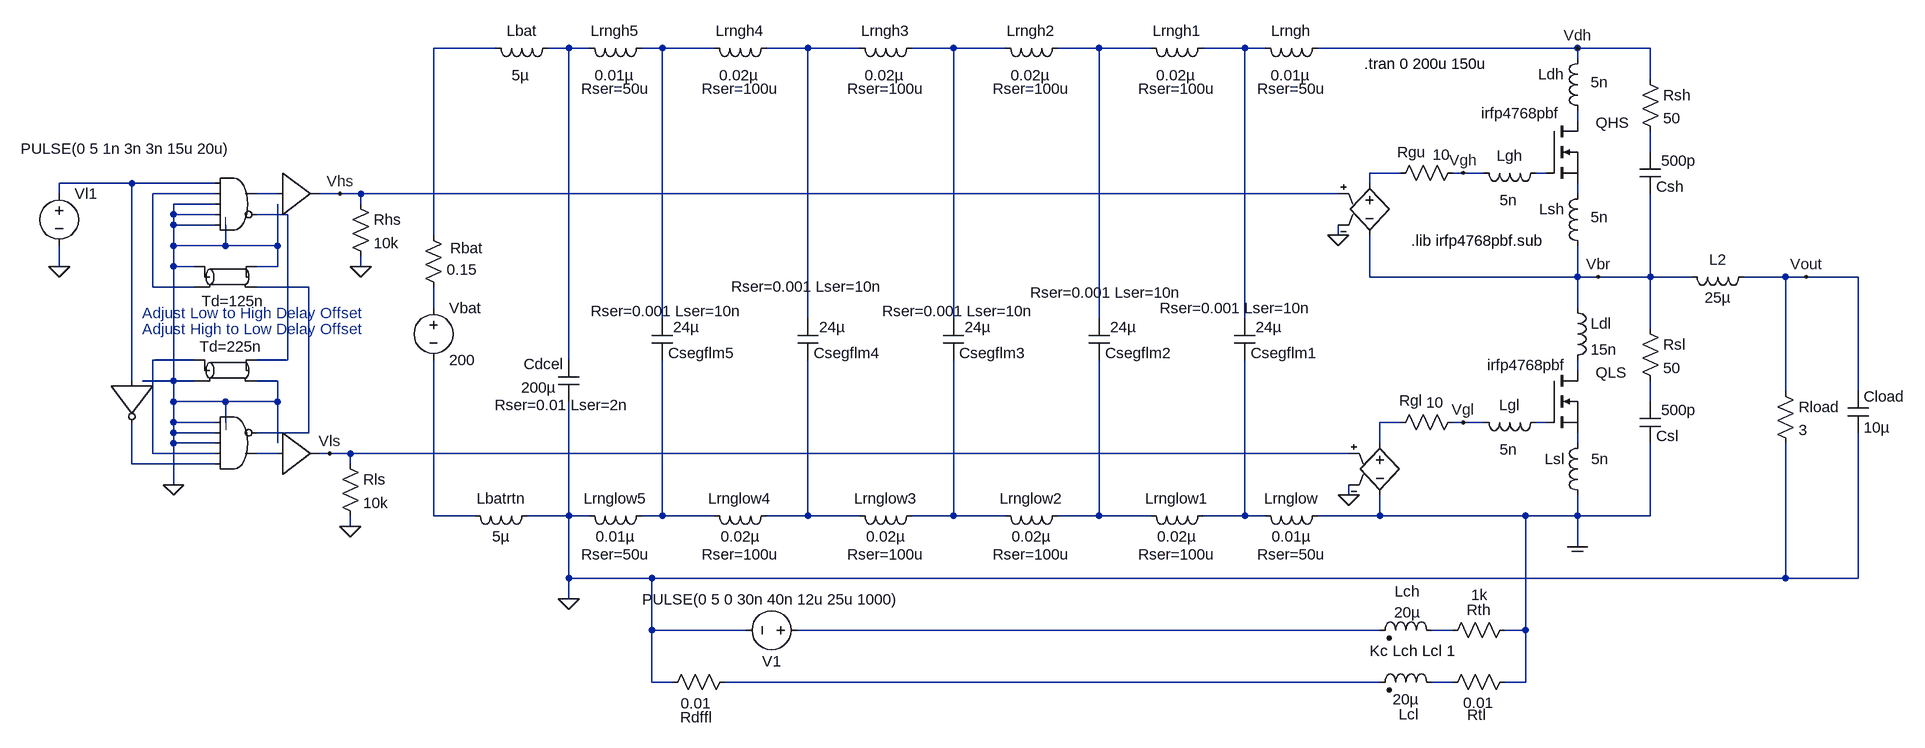
[diagram p0: schematic ETdcdc.asc]
ETdcdc.asc, the LTspice schematic file:
Version 4
SHEET 1 880 768
WIRE -3008 -304 -3104 -304
WIRE -2896 -304 -2928 -304
WIRE -2864 -304 -2896 -304
WIRE -2752 -304 -2784 -304
WIRE -2672 -304 -2752 -304
WIRE -2528 -304 -2592 -304
WIRE -2448 -304 -2528 -304
WIRE -2304 -304 -2368 -304
WIRE -2224 -304 -2304 -304
WIRE -2080 -304 -2144 -304
WIRE -2000 -304 -2080 -304
WIRE -1856 -304 -1920 -304
WIRE -1824 -304 -1856 -304
WIRE -1344 -304 -1744 -304
WIRE -1232 -304 -1344 -304
WIRE -1344 -288 -1344 -304
WIRE -1232 -256 -1232 -304
WIRE -1344 -192 -1344 -208
WIRE -1232 -144 -1232 -176
WIRE -1616 -112 -1664 -112
WIRE -1520 -112 -1536 -112
WIRE -1488 -112 -1520 -112
WIRE -1392 -112 -1408 -112
WIRE -3568 -96 -3680 -96
WIRE -3440 -96 -3568 -96
WIRE -1664 -96 -1664 -112
WIRE -3680 -80 -3680 -96
WIRE -3440 -80 -3536 -80
WIRE -3344 -80 -3376 -80
WIRE -3248 -80 -3280 -80
WIRE -3216 -80 -3248 -80
WIRE -1712 -80 -3216 -80
WIRE -1344 -80 -1344 -96
WIRE -3440 -64 -3504 -64
WIRE -3216 -64 -3216 -80
WIRE -3504 -48 -3504 -64
WIRE -3440 -48 -3504 -48
WIRE -3328 -48 -3376 -48
WIRE -3504 -32 -3504 -48
WIRE -3440 -32 -3504 -32
WIRE -3104 -16 -3104 -304
WIRE -1712 -16 -1712 -32
WIRE -3504 0 -3504 -32
WIRE -3424 0 -3424 -32
WIRE -3424 0 -3504 0
WIRE -3344 0 -3344 -64
WIRE -3344 0 -3424 0
WIRE -3680 32 -3680 0
WIRE -3504 32 -3504 0
WIRE -3472 32 -3504 32
WIRE -3344 32 -3344 0
WIRE -3344 32 -3376 32
WIRE -3216 32 -3216 16
WIRE -1664 48 -1664 -16
WIRE -1344 48 -1344 0
WIRE -1344 48 -1664 48
WIRE -1312 48 -1344 48
WIRE -1232 48 -1232 -80
WIRE -1232 48 -1312 48
WIRE -1168 48 -1232 48
WIRE -1024 48 -1088 48
WIRE -992 48 -1024 48
WIRE -912 48 -992 48
WIRE -3536 64 -3536 -80
WIRE -3472 64 -3536 64
WIRE -3296 64 -3376 64
WIRE -3104 96 -3104 64
WIRE -1344 96 -1344 48
WIRE -2752 112 -2752 -304
WIRE -2528 112 -2528 -304
WIRE -2304 112 -2304 -304
WIRE -2080 112 -2080 -304
WIRE -1856 112 -1856 -304
WIRE -1232 128 -1232 48
WIRE -3472 176 -3536 176
WIRE -3328 176 -3328 -48
WIRE -3328 176 -3376 176
WIRE -2896 176 -2896 -304
WIRE -1344 192 -1344 176
WIRE -3568 208 -3568 -96
WIRE -3504 208 -3504 32
WIRE -3504 208 -3552 208
WIRE -3472 208 -3504 208
WIRE -3344 208 -3376 208
WIRE -1024 224 -1024 48
WIRE -912 224 -912 48
WIRE -3504 240 -3504 208
WIRE -3424 240 -3504 240
WIRE -3344 240 -3344 208
WIRE -3344 240 -3424 240
WIRE -1232 240 -1232 208
WIRE -3504 272 -3504 240
WIRE -3440 272 -3504 272
WIRE -3424 272 -3424 240
WIRE -1616 272 -1648 272
WIRE -1520 272 -1536 272
WIRE -1488 272 -1520 272
WIRE -1392 272 -1408 272
WIRE -3504 288 -3504 272
WIRE -3440 288 -3504 288
WIRE -3296 288 -3296 64
WIRE -3296 288 -3376 288
WIRE -3504 304 -3504 288
WIRE -3440 304 -3504 304
WIRE -3344 304 -3344 240
WIRE -1648 304 -1648 272
WIRE -1344 304 -1344 288
WIRE -3536 320 -3536 176
WIRE -3440 320 -3536 320
WIRE -3344 320 -3376 320
WIRE -3264 320 -3280 320
WIRE -3232 320 -3264 320
WIRE -1696 320 -3232 320
WIRE -3568 336 -3568 272
WIRE -3440 336 -3568 336
WIRE -3232 336 -3232 320
WIRE -3504 368 -3504 304
WIRE -1696 384 -1696 368
WIRE -3104 416 -3104 176
WIRE -3040 416 -3104 416
WIRE -2896 416 -2896 240
WIRE -2896 416 -2960 416
WIRE -2864 416 -2896 416
WIRE -2752 416 -2752 176
WIRE -2752 416 -2784 416
WIRE -2672 416 -2752 416
WIRE -2528 416 -2528 176
WIRE -2528 416 -2592 416
WIRE -2448 416 -2528 416
WIRE -2304 416 -2304 176
WIRE -2304 416 -2368 416
WIRE -2224 416 -2304 416
WIRE -2080 416 -2080 176
WIRE -2080 416 -2144 416
WIRE -2000 416 -2080 416
WIRE -1856 416 -1856 176
WIRE -1856 416 -1920 416
WIRE -1824 416 -1856 416
WIRE -1648 416 -1648 384
WIRE -1648 416 -1744 416
WIRE -1424 416 -1648 416
WIRE -1344 416 -1344 384
WIRE -1344 416 -1424 416
WIRE -1232 416 -1232 304
WIRE -1232 416 -1344 416
WIRE -3232 432 -3232 416
WIRE -1344 464 -1344 416
WIRE -2896 512 -2896 416
WIRE -2768 512 -2896 512
WIRE -1024 512 -1024 304
WIRE -1024 512 -2768 512
WIRE -912 512 -912 288
WIRE -912 512 -1024 512
WIRE -2896 544 -2896 512
WIRE -2768 592 -2768 512
WIRE -2624 592 -2768 592
WIRE -1648 592 -2544 592
WIRE -1536 592 -1568 592
WIRE -1424 592 -1424 416
WIRE -1424 592 -1456 592
WIRE -2768 672 -2768 592
WIRE -2736 672 -2768 672
WIRE -1648 672 -2656 672
WIRE -1536 672 -1568 672
WIRE -1424 672 -1424 592
WIRE -1424 672 -1456 672
FLAG -2896 544 0
FLAG -992 48 Vout
FLAG -3232 432 0
FLAG -3504 368 0
FLAG -3216 32 0
FLAG -3680 32 0
FLAG -3264 320 Vls
FLAG -3248 -80 Vhs
FLAG -1712 -16 0
FLAG -1696 384 0
FLAG -1344 464 COM
FLAG -1312 48 Vbr
FLAG -1520 -112 Vgh
FLAG -1520 272 Vgl
FLAG -1344 -304 Vdh
SYMBOL ind -2944 400 R90
WINDOW 0 5 56 VBottom 2
WINDOW 3 32 56 VTop 2
SYMATTR InstName Lbatrtn
SYMATTR Value 5µ
SYMATTR SpiceLine Ipk=0.21 Rser=0 Rpar=0 Cpar=0
SYMBOL voltage -3104 80 R0
WINDOW 123 0 0 Left 2
WINDOW 39 0 0 Left 2
SYMATTR InstName Vbat
SYMATTR Value 200
SYMBOL ind -1360 80 R0
SYMATTR InstName Ldl
SYMATTR Value 15n
SYMBOL ind -1328 -96 M0
WINDOW 3 -31 52 Left 2
SYMATTR Value 5n
SYMATTR InstName Lsh
SYMATTR SpiceLine Rser=1m
SYMBOL res -1632 -96 R270
WINDOW 0 32 33 VTop 2
WINDOW 3 60 79 VBottom 2
SYMATTR InstName Rgu
SYMATTR Value 10
SYMBOL ind -1328 288 M0
WINDOW 3 -32 40 Left 2
SYMATTR Value 5n
SYMATTR InstName Lsl
SYMBOL res -1632 288 R270
WINDOW 0 34 32 VTop 2
WINDOW 3 62 69 VBottom 2
SYMATTR InstName Rgl
SYMATTR Value 10
SYMBOL nmos -1392 192 R0
WINDOW 0 76 3 Left 2
WINDOW 3 -91 -8 Left 2
SYMATTR InstName QLS
SYMATTR Value irfp4768pbf
SYMATTR Prefix X
SYMBOL ind -3024 -320 M90
WINDOW 0 5 56 VBottom 2
WINDOW 3 42 54 VTop 2
SYMATTR InstName Lbat
SYMATTR Value 5µ
SYMBOL ind -1184 32 M90
WINDOW 0 5 56 VBottom 2
WINDOW 3 32 56 VTop 2
SYMATTR InstName L2
SYMATTR Value 25µ
SYMBOL res -1040 208 R0
SYMATTR InstName Rload
SYMATTR Value 3
SYMBOL cap -928 224 R0
SYMATTR InstName Cload
SYMATTR Value 10µ
SYMBOL res -3248 320 R0
SYMATTR InstName Rls
SYMATTR Value 10k
SYMBOL tline -3424 192 R0
WINDOW 0 -2 -28 Invisible 2
WINDOW 3 9 -52 Top 2
SYMATTR InstName T2
SYMATTR Value Td=225n
SYMATTR Value2 Z0=50
SYMBOL res -3232 -80 R0
SYMATTR InstName Rhs
SYMATTR Value 10k
SYMBOL voltage -3680 -96 R0
WINDOW 3 -59 -53 Left 2
WINDOW 123 0 0 Left 2
WINDOW 39 0 0 Left 2
SYMATTR Value PULSE(0 5 1n 3n 3n 15u 20u)
SYMATTR InstName Vl1
SYMBOL Digital\\and -3408 -128 R0
WINDOW 0 16 24 Invisible 2
SYMATTR InstName A1
SYMATTR SpiceLine Vhigh=5 Rhigh=50 Rlow=50 Rout=50
SYMBOL Digital\\and -3408 368 M180
WINDOW 0 16 24 Invisible 2
SYMATTR InstName A2
SYMATTR SpiceLine Vhigh=5 Rhigh=50 Rlow=50 Rout=50
SYMBOL Digital\\inv -3632 208 M90
WINDOW 0 8 32 Invisible 2
SYMATTR InstName A4
SYMATTR SpiceLine Vhigh=5
SYMBOL Digital\\buf1 -3344 -144 R0
WINDOW 0 8 32 Invisible 2
SYMATTR InstName A3
SYMATTR SpiceLine Vhigh=12 Trise=60n Tfall=40n Ref=0.2
SYMBOL Digital\\buf1 -3344 384 M180
WINDOW 0 8 32 Invisible 2
SYMATTR InstName A5
SYMATTR SpiceLine Vhigh=12 Trise=60n Tfall=40n Ref=0.2
SYMBOL e -1664 -112 R0
WINDOW 0 24 16 Invisible 2
WINDOW 3 24 96 Invisible 2
SYMATTR InstName E1
SYMATTR Value 1
SYMBOL e -1648 288 R0
WINDOW 0 24 16 Invisible 2
WINDOW 3 24 96 Invisible 2
SYMATTR InstName E2
SYMATTR Value 1
SYMBOL nmos -1392 -192 R0
WINDOW 0 76 3 Left 2
WINDOW 3 -100 -12 Left 2
SYMATTR InstName QHS
SYMATTR Value irfp4768pbf
SYMATTR Prefix X
SYMBOL cap -2912 176 R0
WINDOW 0 -53 6 Left 2
WINDOW 3 -57 42 Left 2
WINDOW 39 -98 69 Left 2
SYMATTR InstName Cdcel
SYMATTR Value 200µ
SYMATTR SpiceLine Rser=0.01 Lser=2n
SYMBOL tline -3424 48 R0
WINDOW 0 -2 -28 Invisible 2
WINDOW 3 12 22 Top 2
SYMATTR InstName T1
SYMATTR Value Td=125n
SYMATTR Value2 Z0=50
SYMBOL ind -1728 400 R90
WINDOW 0 5 56 VBottom 2
WINDOW 3 32 56 VTop 2
WINDOW 39 60 56 VTop 2
SYMATTR InstName Lrnglow
SYMATTR Value 0.01µ
SYMATTR SpiceLine Rser=50u
SYMBOL ind -1840 -320 M90
WINDOW 0 5 56 VBottom 2
WINDOW 3 42 54 VTop 2
WINDOW 39 94 56 VBottom 2
SYMATTR InstName Lrngh
SYMATTR Value 0.01µ
SYMATTR SpiceLine Rser=50u
SYMBOL cap -1872 112 R0
WINDOW 0 25 53 Left 2
WINDOW 3 33 13 Left 2
WINDOW 39 -115 -16 Left 2
SYMATTR InstName Csegflm1
SYMATTR Value 24µ
SYMATTR SpiceLine Rser=0.001 Lser=10n
SYMBOL ind -1904 400 R90
WINDOW 0 5 56 VBottom 2
WINDOW 3 32 56 VTop 2
WINDOW 39 60 56 VTop 2
SYMATTR InstName Lrnglow1
SYMATTR Value 0.02µ
SYMATTR SpiceLine Rser=100u
SYMBOL ind -2016 -320 M90
WINDOW 0 5 56 VBottom 2
WINDOW 3 42 54 VTop 2
WINDOW 39 94 56 VBottom 2
SYMATTR InstName Lrngh1
SYMATTR Value 0.02µ
SYMATTR SpiceLine Rser=100u
SYMBOL cap -2096 112 R0
WINDOW 0 25 53 Left 2
WINDOW 3 33 13 Left 2
WINDOW 39 -90 -40 Left 2
SYMATTR InstName Csegflm2
SYMATTR Value 24µ
SYMATTR SpiceLine Rser=0.001 Lser=10n
SYMBOL cap -2320 112 R0
WINDOW 0 25 53 Left 2
WINDOW 3 33 13 Left 2
WINDOW 39 -94 -11 Left 2
SYMATTR InstName Csegflm3
SYMATTR Value 24µ
SYMATTR SpiceLine Rser=0.001 Lser=10n
SYMBOL cap -2544 112 R0
WINDOW 0 25 53 Left 2
WINDOW 3 33 13 Left 2
WINDOW 39 -102 -49 Left 2
SYMATTR InstName Csegflm4
SYMATTR Value 24µ
SYMATTR SpiceLine Rser=0.001 Lser=10n
SYMBOL cap -2768 112 R0
WINDOW 0 25 53 Left 2
WINDOW 3 33 13 Left 2
WINDOW 39 -94 -11 Left 2
SYMATTR InstName Csegflm5
SYMATTR Value 24µ
SYMATTR SpiceLine Rser=0.001 Lser=10n
SYMBOL ind -2240 -320 M90
WINDOW 0 5 56 VBottom 2
WINDOW 3 42 54 VTop 2
WINDOW 39 94 56 VBottom 2
SYMATTR InstName Lrngh2
SYMATTR Value 0.02µ
SYMATTR SpiceLine Rser=100u
SYMBOL ind -2464 -320 M90
WINDOW 0 5 56 VBottom 2
WINDOW 3 42 54 VTop 2
WINDOW 39 94 56 VBottom 2
SYMATTR InstName Lrngh3
SYMATTR Value 0.02µ
SYMATTR SpiceLine Rser=100u
SYMBOL ind -2688 -320 M90
WINDOW 0 5 56 VBottom 2
WINDOW 3 42 54 VTop 2
WINDOW 39 94 56 VBottom 2
SYMATTR InstName Lrngh4
SYMATTR Value 0.02µ
SYMATTR SpiceLine Rser=100u
SYMBOL ind -2880 -320 M90
WINDOW 0 5 56 VBottom 2
WINDOW 3 42 54 VTop 2
WINDOW 39 94 56 VBottom 2
SYMATTR InstName Lrngh5
SYMATTR Value 0.01µ
SYMATTR SpiceLine Rser=50u
SYMBOL ind -2128 400 R90
WINDOW 0 5 56 VBottom 2
WINDOW 3 32 56 VTop 2
WINDOW 39 60 56 VTop 2
SYMATTR InstName Lrnglow2
SYMATTR Value 0.02µ
SYMATTR SpiceLine Rser=100u
SYMBOL ind -2352 400 R90
WINDOW 0 5 56 VBottom 2
WINDOW 3 32 56 VTop 2
WINDOW 39 60 56 VTop 2
SYMATTR InstName Lrnglow3
SYMATTR Value 0.02µ
SYMATTR SpiceLine Rser=100u
SYMBOL ind -2576 400 R90
WINDOW 0 5 56 VBottom 2
WINDOW 3 32 56 VTop 2
WINDOW 39 60 56 VTop 2
SYMATTR InstName Lrnglow4
SYMATTR Value 0.02µ
SYMATTR SpiceLine Rser=100u
SYMBOL ind -2768 400 R90
WINDOW 0 5 56 VBottom 2
WINDOW 3 32 56 VTop 2
WINDOW 39 60 56 VTop 2
SYMATTR InstName Lrnglow5
SYMATTR Value 0.01µ
SYMATTR SpiceLine Rser=50u
SYMBOL ind -1328 -304 M0
WINDOW 3 -31 52 Left 2
SYMATTR Value 5n
SYMATTR InstName Ldh
SYMATTR SpiceLine Rser=1m
SYMBOL ind -1504 -128 M90
WINDOW 0 5 56 VBottom 2
WINDOW 3 42 54 VTop 2
WINDOW 39 94 56 VBottom 2
SYMATTR InstName Lgh
SYMATTR Value 5n
SYMBOL ind -1504 256 M90
WINDOW 0 5 56 VBottom 2
WINDOW 3 42 54 VTop 2
WINDOW 39 94 56 VBottom 2
SYMATTR InstName Lgl
SYMATTR Value 5n
SYMBOL res -3120 -32 R0
WINDOW 0 42 36 Left 2
WINDOW 3 36 69 Left 2
SYMATTR InstName Rbat
SYMATTR Value 0.15
SYMBOL res -1248 -272 R0
SYMATTR InstName Rsh
SYMATTR Value 50
SYMBOL cap -1248 -144 R0
WINDOW 0 25 53 Left 2
WINDOW 3 33 13 Left 2
SYMATTR InstName Csh
SYMATTR Value 500p
SYMBOL res -1248 112 R0
SYMATTR InstName Rsl
SYMATTR Value 50
SYMBOL cap -1248 240 R0
WINDOW 0 25 53 Left 2
WINDOW 3 33 13 Left 2
SYMATTR InstName Csl
SYMATTR Value 500p
SYMBOL res -1440 576 R90
WINDOW 0 0 56 VBottom 2
WINDOW 3 -54 55 VTop 2
SYMATTR InstName Rth
SYMATTR Value 1k
SYMBOL res -1552 688 R270
WINDOW 0 -50 53 VTop 2
WINDOW 3 0 56 VBottom 2
SYMATTR InstName Rtl
SYMATTR Value 0.01
SYMBOL res -2640 656 R90
WINDOW 0 86 60 VBottom 2
WINDOW 3 33 60 VTop 2
SYMATTR InstName Rdffl
SYMATTR Value 0.01
SYMBOL ind2 -1552 608 M270
WINDOW 0 60 54 VTop 2
WINDOW 3 59 54 VBottom 2
SYMATTR InstName Lch
SYMATTR Value 20µ
SYMATTR SpiceLine Rser=1m
SYMATTR Type ind
SYMBOL ind2 -1552 688 M270
WINDOW 0 -49 52 VTop 2
WINDOW 3 5 56 VBottom 2
SYMATTR InstName Lcl
SYMATTR Value 20µ
SYMATTR SpiceLine Rser=1m
SYMATTR Type ind
SYMBOL voltage -2528 592 R90
WINDOW 0 32 56 VTop 2
WINDOW 3 -32 56 VBottom 2
WINDOW 123 0 0 Left 2
WINDOW 39 0 0 Left 2
SYMATTR InstName V1
SYMATTR Value PULSE(0 5 0 30n 40n 12u 25u 1000)
TEXT -1672 -280 Left 2 !.tran 0 200u 150u
TEXT -1600 -8 Left 2 !.lib irfp4768pbf.sub
TEXT -3552 128 Left 2 ;Adjust High to Low Delay Offset
TEXT -3552 104 Left 2 ;Adjust Low to High Delay Offset
TEXT -1664 624 Left 2 !Kc Lch Lcl 1

The netlist it stands for:
* ETdcdc.asc
Lbatrtn 0 N027 5µ Ipk=0.21 Rser=0 Rpar=0 Cpar=0
Vbat N018 N027 200
Ldl Vbr N020 15n
Lsh N015 Vbr 5n Rser=1m
Rgu N010 Vgh 10
Lsl N024 COM 5n
Rgl N022 Vgl 10
XQLS N020 N023 N024 irfp4768pbf  ; pins D G S
Lbat N001 N002 5µ
L2 Vbr Vout 25µ
Rload Vout 0 3
Cload Vout 0 10µ
Rls Vls 0 10k
T2 N019 0 N016 0 Td=225n Z0=50
Rhs Vhs 0 10k
Vl1 N012 0 PULSE(0 5 1n 3n 3n 15u 20u)
A1 N012 N013 0 0 0 N016 N014 0 AND Vhigh=5 Rhigh=50 Rlow=50 Rout=50
A2 N026 N019 0 0 0 N017 N025 0 AND Vhigh=5 Rhigh=50 Rlow=50 Rout=50
A4 N012 0 0 0 0 N026 0 0 BUF Vhigh=5
A3 N014 0 0 0 0 0 Vhs 0 BUF Vhigh=12 Trise=60n Tfall=40n Ref=0.2
A5 N025 0 0 0 0 0 Vls 0 BUF Vhigh=12 Trise=60n Tfall=40n Ref=0.2
E1 N010 Vbr Vhs 0 1
E2 N022 COM Vls 0 1
XQHS N008 N011 N015 irfp4768pbf  ; pins D G S
Cdcel N002 0 200µ Rser=0.01 Lser=2n
T1 0 N013 0 N017 Td=125n Z0=50
Lrnglow COM N032 0.01µ Rser=50u
Lrngh N007 Vdh 0.01µ Rser=50u
Csegflm1 N007 N032 24µ Rser=0.001 Lser=10n
Lrnglow1 N032 N031 0.02µ Rser=100u
Lrngh1 N006 N007 0.02µ Rser=100u
Csegflm2 N006 N031 24µ Rser=0.001 Lser=10n
Csegflm3 N005 N030 24µ Rser=0.001 Lser=10n
Csegflm4 N004 N029 24µ Rser=0.001 Lser=10n
Csegflm5 N003 N028 24µ Rser=0.001 Lser=10n
Lrngh2 N005 N006 0.02µ Rser=100u
Lrngh3 N004 N005 0.02µ Rser=100u
Lrngh4 N003 N004 0.02µ Rser=100u
Lrngh5 N002 N003 0.01µ Rser=50u
Lrnglow2 N031 N030 0.02µ Rser=100u
Lrnglow3 N030 N029 0.02µ Rser=100u
Lrnglow4 N029 N028 0.02µ Rser=100u
Lrnglow5 N028 0 0.01µ Rser=50u
Ldh Vdh N008 5n Rser=1m
Lgh Vgh N011 5n
Lgl Vgl N023 5n
Rbat N001 N018 0.15
Rsh Vdh N009 50
Csh N009 Vbr 500p
Rsl Vbr N021 50
Csl N021 COM 500p
Rth COM N034 1k
Rtl N036 COM 0.01
Rdffl N035 0 0.01
Lch N034 N033 20µ Rser=1m
Lcl N036 N035 20µ Rser=1m
V1 N033 0 PULSE(0 5 0 30n 40n 12u 25u 1000)
.tran 0 200u 150u
.lib irfp4768pbf.sub
* Adjust High to Low Delay Offset
* Adjust Low to High Delay Offset
Kc Lch Lcl 1
.backanno
.end